# EasyEDA schematic 1-Schematic_5C1555.json
TITLE: 555; REV: 1.0; Date: 2022-10-19; Sheet: 1/1; Drawn By: BH2VGM; Company: NEU
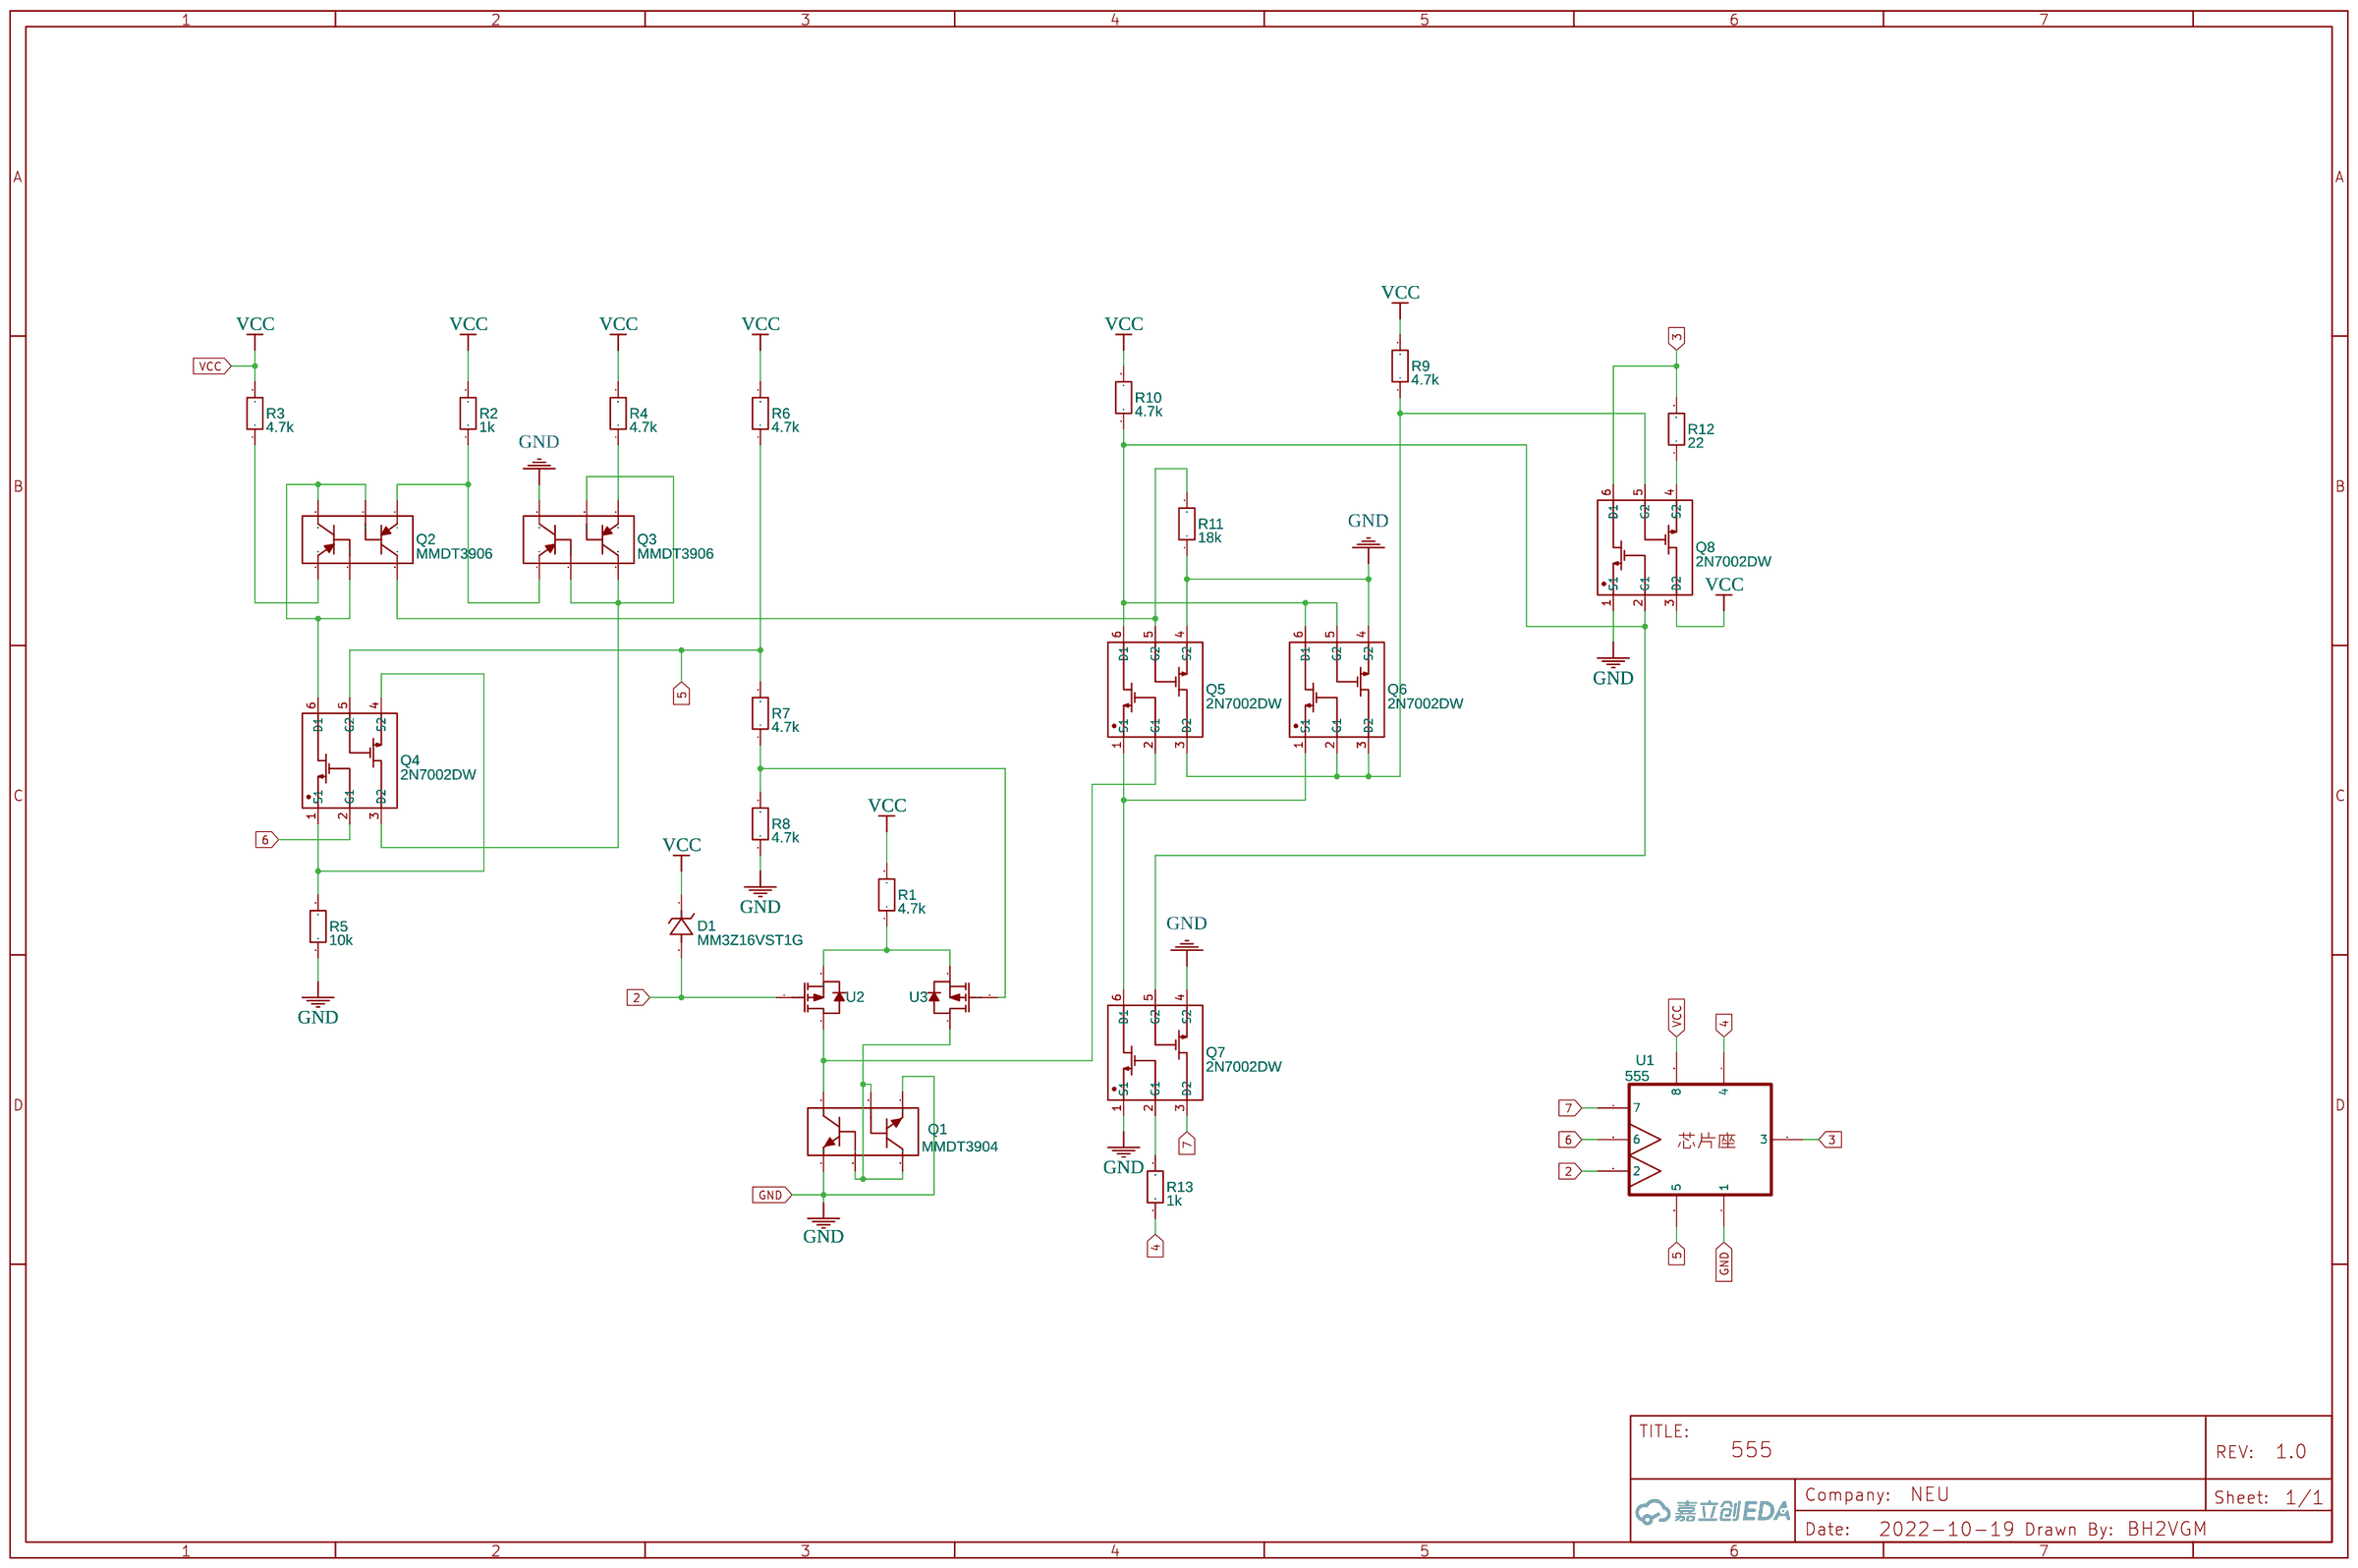
[diagram p0: schematic sheet]

## Parts
D1  MM3Z16VST1G  [SC-76_L1.7-W1.3-LS2.6-RD]
Q1  MMDT3904  [SOT-363]
Q2  MMDT3906  [SOT-363]
Q3  MMDT3906  [SOT-363]
Q4  2N7002DW  [SOT-363-6_L2.0-W1.3-P0.65-LS2.3-BL]
Q5  2N7002DW  [SOT-363-6_L2.0-W1.3-P0.65-LS2.3-BL]
Q6  2N7002DW  [SOT-363-6_L2.0-W1.3-P0.65-LS2.3-BL]
Q7  2N7002DW  [SOT-363-6_L2.0-W1.3-P0.65-LS2.3-BL]
Q8  2N7002DW  [SOT-363-6_L2.0-W1.3-P0.65-LS2.3-BL]
R1  4.7k  [R0805]
R2  1k  [R0805]
R3  4.7k  [R0805]
R4  4.7k  [R0805]
R5  10k  [R0805]
R6  4.7k  [R0805]
R7  4.7k  [R0805]
R8  4.7k  [R0805]
R9  4.7k  [R0805]
R10  4.7k  [R0805]
R11  18k  [R0805]
R12  22  [R0805]
R13  1k  [R0805]
U1  555  [DIP8]
U2  BSS84-H  [SOT-23-3_L2.9-W1.3-P1.90-LS2.8-BR]
U3  BSS84-H  [SOT-23-3_L2.9-W1.3-P1.90-LS2.8-BR]

## Library data of the parts
D1 = MM3Z16VST1G: Supplier: LCSC; Supplier Part: C603317; Manufacturer: onsemi(安森美); Contributor: LCSC; JLCPCB Part Class: Extended Part
Q1 = MMDT3904: Supplier: LCSC; Manufacturer: DIODES; Manufacturer Part: MMDT3904-7-F; Supplier Part: C83572; JLCPCB Part Class: Extended Part; Contributor: king13478509115
Q2 Q3 = MMDT3906: Supplier: LCSC; Supplier Part: C779248; Manufacturer: MCC(Micro Commercial Components); Manufacturer Part: MMDT3906-TP; Contributor: king13478509115; JLCPCB Part Class: Extended Part
Q4-Q8 = 2N7002DW: Supplier: LCSC; Supplier Part: C194045; Manufacturer: Micro Commercial Components; Manufacturer Part: 2N7002DW-TP; Contributor: king13478509115; JLCPCB Part Class: Extended Part
R1-R13 = HOLR0805-1/2W-10MR-1%: Supplier: LCSC; Supplier Part: C2912660; Manufacturer: Milliohm(毫欧); Manufacturer Part: HoLR0805-1/2W-10mR-1%; Contributor: lcsc
U1 = 555: Contributor: king13478509115
U2 U3 = BSS84-H: Supplier: LCSC; Supplier Part: C890268; Manufacturer: onsemi(安森美); link: https://atta.szlcsc.comnull; Contributor: lcsc

## Nets
GND: Q1.1(E) Q1.4(E) Q3.6(C) Q5.4(S2) Q6.4(S2) Q7.1(S1) Q7.4(S2) Q8.1(S1) R5.1 R8.1 R11.1 U1.1
VCC: D1.1(K) Q8.3(D2) R1.2 R2.2 R3.2 R4.2 R6.2 R9.2 R10.2 U1.8
2: D1.2(A) U1.2 U2.1(G)
3: Q8.6(D1) R12.2 U1.3
4: R13.1 U1.4
5: Q4.5(G2) R6.1 R7.2 U1.5
6: Q4.2(G1) U1.6
7: Q7.3(D2) U1.7
Net-(Q1-2): Q1.2(B) Q1.3(C) Q1.5(B) U3.3(D)
Net-(Q1-6): Q1.6(C) Q5.2(G1) U2.3(D)
Net-(Q2-1): Q2.1(E) R3.1
Net-(Q2-2): Q2.2(B) Q2.5(B) Q2.6(C) Q4.6(D1)
Net-(Q2-3): Q2.3(C) Q5.5(G2) R11.2
Net-(Q2-4): Q2.4(E) Q3.1(E) R2.1
Net-(Q3-2): Q3.2(B) Q3.3(C) Q3.5(B) Q4.3(D2)
Net-(Q3-4): Q3.4(E) R4.1
Net-(Q4-1): Q4.1(S1) Q4.4(S2) R5.2
Net-(Q5-1): Q5.1(S1) Q6.1(S1) Q7.6(D1)
Net-(Q5-3): Q5.3(D2) Q6.2(G1) Q6.3(D2) Q8.5(G2) R9.1
Net-(Q5-6): Q5.6(D1) Q6.5(G2) Q6.6(D1) Q7.5(G2) Q8.2(G1) R10.1
Net-(Q7-2): Q7.2(G1) R13.2
Net-(Q8-4): Q8.4(S2) R12.1
Net-(R1-1): R1.1 U2.2(S) U3.2(S)
Net-(R7-1): R7.1 R8.2 U3.1(G)
